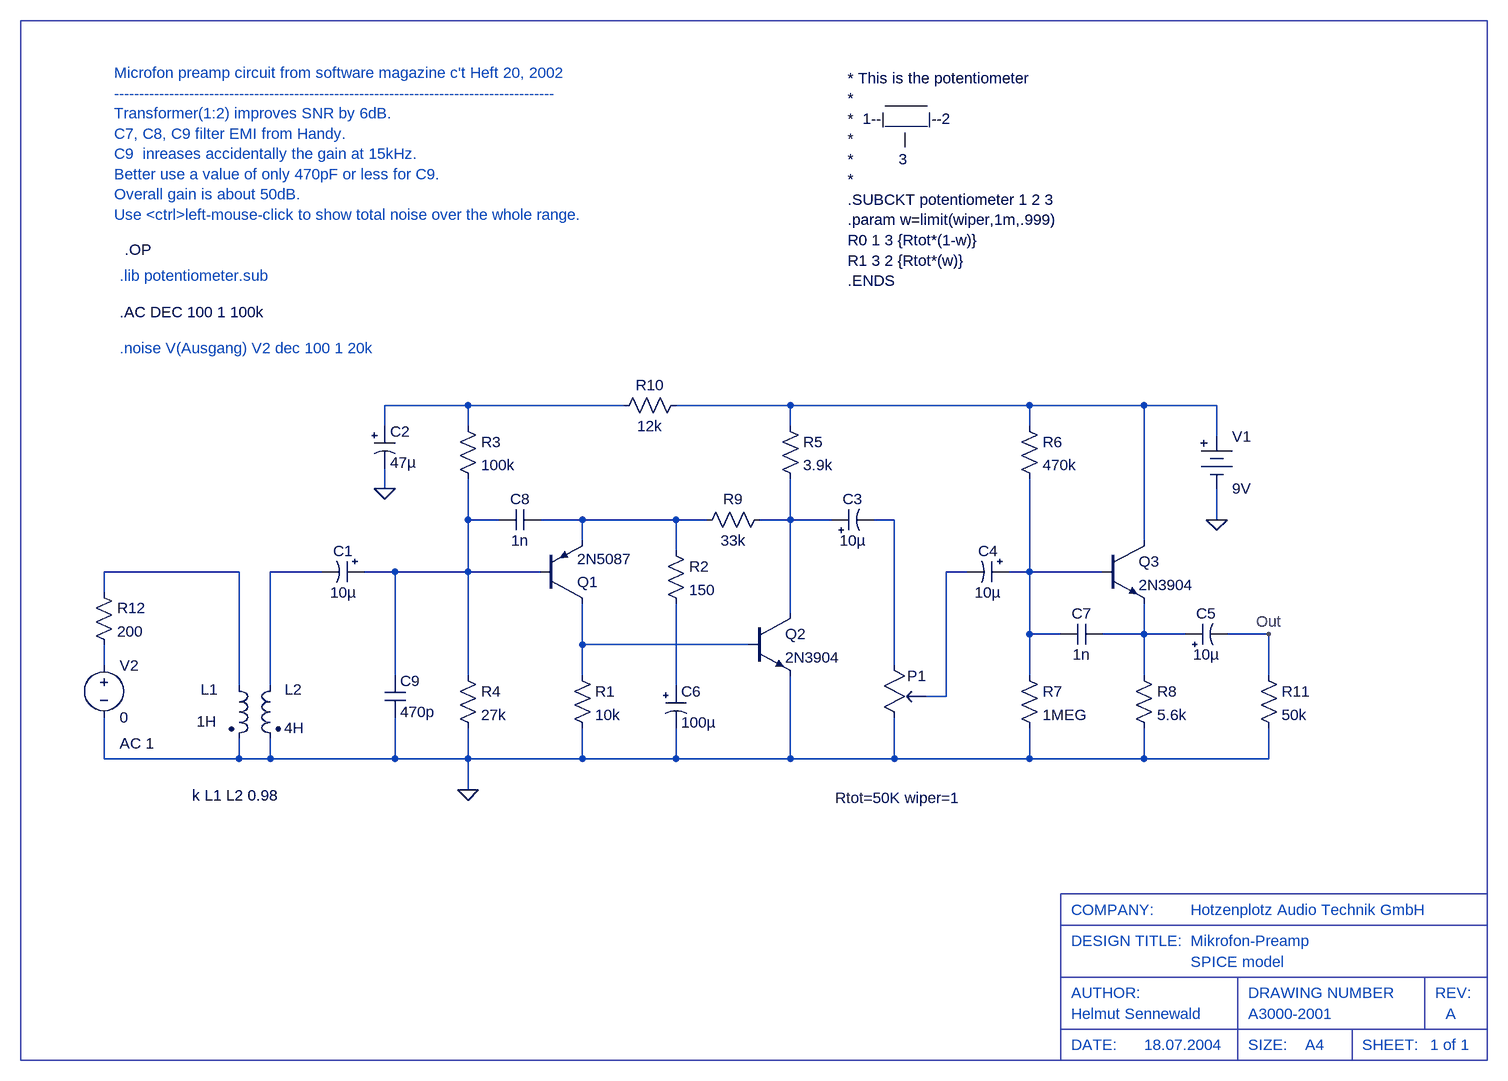
[diagram p0: schematic p4_example.asc]
p4_example.asc, the LTspice schematic file:
Version 4
SHEET 1 2260 1604
WIRE 128 880 128 848
WIRE 128 992 128 960
WIRE 128 1136 128 1072
WIRE 336 848 128 848
WIRE 336 1024 336 848
WIRE 336 1136 128 1136
WIRE 336 1136 336 1104
WIRE 384 1024 384 848
WIRE 384 1136 336 1136
WIRE 384 1136 384 1104
WIRE 464 848 384 848
WIRE 560 624 560 592
WIRE 560 720 560 688
WIRE 576 848 528 848
WIRE 576 1008 576 848
WIRE 576 1136 384 1136
WIRE 576 1136 576 1072
WIRE 688 592 560 592
WIRE 688 624 688 592
WIRE 688 768 688 704
WIRE 688 848 576 848
WIRE 688 848 688 768
WIRE 688 1008 688 848
WIRE 688 1136 576 1136
WIRE 688 1136 688 1088
WIRE 688 1184 688 1136
WIRE 736 768 688 768
WIRE 800 848 688 848
WIRE 864 768 800 768
WIRE 864 800 864 768
WIRE 864 960 864 896
WIRE 864 1008 864 960
WIRE 864 1136 688 1136
WIRE 864 1136 864 1088
WIRE 928 592 688 592
WIRE 1008 768 864 768
WIRE 1008 816 1008 768
WIRE 1008 1024 1008 896
WIRE 1008 1136 864 1136
WIRE 1008 1136 1008 1088
WIRE 1056 768 1008 768
WIRE 1120 960 864 960
WIRE 1184 592 1008 592
WIRE 1184 624 1184 592
WIRE 1184 768 1136 768
WIRE 1184 768 1184 704
WIRE 1184 912 1184 768
WIRE 1184 1136 1008 1136
WIRE 1184 1136 1184 1008
WIRE 1248 768 1184 768
WIRE 1344 768 1312 768
WIRE 1344 992 1344 768
WIRE 1344 1136 1184 1136
WIRE 1344 1136 1344 1072
WIRE 1424 1040 1392 1040
WIRE 1424 1040 1424 848
WIRE 1456 848 1424 848
WIRE 1552 592 1184 592
WIRE 1552 624 1552 592
WIRE 1552 848 1520 848
WIRE 1552 848 1552 704
WIRE 1552 944 1552 848
WIRE 1552 1008 1552 944
WIRE 1552 1136 1344 1136
WIRE 1552 1136 1552 1088
WIRE 1600 944 1552 944
WIRE 1664 848 1552 848
WIRE 1728 592 1552 592
WIRE 1728 800 1728 592
WIRE 1728 944 1664 944
WIRE 1728 944 1728 896
WIRE 1728 1008 1728 944
WIRE 1728 1136 1552 1136
WIRE 1728 1136 1728 1088
WIRE 1792 944 1728 944
WIRE 1840 592 1728 592
WIRE 1840 640 1840 592
WIRE 1840 768 1840 720
WIRE 1920 944 1856 944
WIRE 1920 1008 1920 944
WIRE 1920 1136 1728 1136
WIRE 1920 1136 1920 1088
FLAG 560 720 0
FLAG 1840 768 0
FLAG 688 1184 0
FLAG 1920 944 Out
SYMBOL pnp 800 896 M180
SYMATTR InstName Q1
SYMATTR Value 2N5087
SYMBOL npn 1120 912 R0
SYMATTR InstName Q2
SYMATTR Value 2N3904
SYMBOL npn 1664 800 R0
SYMATTR InstName Q3
SYMATTR Value 2N3904
SYMBOL res 848 992 R0
SYMATTR InstName R1
SYMATTR Value 10k
SYMBOL res 992 800 R0
SYMATTR InstName R2
SYMATTR Value 150
SYMBOL res 672 608 R0
SYMATTR InstName R3
SYMATTR Value 100k
SYMBOL res 672 992 R0
SYMATTR InstName R4
SYMATTR Value 27k
SYMBOL res 1168 608 R0
SYMATTR InstName R5
SYMATTR Value 3.9k
SYMBOL res 1536 608 R0
SYMATTR InstName R6
SYMATTR Value 470k
SYMBOL res 1536 992 R0
SYMATTR InstName R7
SYMATTR Value 1MEG
SYMBOL res 1712 992 R0
SYMATTR InstName R8
SYMATTR Value 5.6k
SYMBOL res 1040 784 R270
WINDOW 0 32 56 VTop 0
WINDOW 3 0 56 VBottom 0
SYMATTR InstName R9
SYMATTR Value 33k
SYMBOL res 912 608 R270
WINDOW 0 32 56 VTop 0
WINDOW 3 0 56 VBottom 0
SYMATTR InstName R10
SYMATTR Value 12k
SYMBOL cap 736 784 R270
WINDOW 0 32 32 VTop 0
WINDOW 3 0 32 VBottom 0
SYMATTR InstName C8
SYMATTR Value 1n
SYMBOL Misc\\EuropeanPolcap 544 624 R0
SYMATTR InstName C2
SYMATTR Value 47µ
SYMBOL Misc\\EuropeanPolcap 1248 784 R270
WINDOW 0 32 32 VTop 0
WINDOW 3 0 32 VBottom 0
SYMATTR InstName C3
SYMATTR Value 10µ
SYMBOL Misc\\EuropeanPolcap 1520 832 R90
WINDOW 0 0 32 VBottom 0
WINDOW 3 32 32 VTop 0
SYMATTR InstName C4
SYMATTR Value 10µ
SYMBOL Misc\\EuropeanPolcap 1792 960 R270
WINDOW 0 32 32 VTop 0
WINDOW 3 0 32 VBottom 0
SYMATTR InstName C5
SYMATTR Value 10µ
SYMBOL res 1904 992 R0
SYMATTR InstName R11
SYMATTR Value 50k
SYMBOL Misc\\battery 1840 624 R0
SYMATTR InstName V1
SYMATTR Value 9V
SYMBOL cap 1600 960 R270
WINDOW 0 32 32 VTop 0
WINDOW 3 0 32 VBottom 0
SYMATTR InstName C7
SYMATTR Value 1n
SYMBOL Misc\\EuropeanPolcap 992 1024 R0
SYMATTR InstName C6
SYMATTR Value 100µ
SYMBOL Misc\\EuropeanPolcap 528 832 R90
WINDOW 0 0 32 VBottom 0
WINDOW 3 32 32 VTop 0
SYMATTR InstName C1
SYMATTR Value 10µ
SYMBOL cap 560 1008 R0
SYMATTR InstName C9
SYMATTR Value 470p
SYMBOL voltage 128 976 R0
WINDOW 39 0 0 Left 0
WINDOW 123 24 136 Left 0
SYMATTR Value2 AC 1
SYMATTR InstName V2
SYMATTR Value 0
SYMBOL res 112 864 R0
SYMATTR InstName R12
SYMATTR Value 200
SYMBOL potentiometer 1328 976 R0
WINDOW 3 -75 220 Left 0
SYMATTR Value Rtot=50K wiper=1
SYMATTR InstName P1
SYMATTR SpiceModel POT
SYMBOL ind2 320 1008 R0
WINDOW 0 -43 21 Left 0
WINDOW 3 -49 70 Left 0
SYMATTR InstName L1
SYMATTR Value 1H
SYMATTR SpiceLine Rser=50
SYMBOL ind2 400 1008 M0
WINDOW 0 -33 21 Left 0
WINDOW 3 -36 80 Left 0
SYMATTR InstName L2
SYMATTR Value 4H
SYMATTR SpiceLine Rser=100
TEXT 2064 1576 Left 0 ;SHEET:
TEXT 1888 1576 Left 0 ;SIZE:
TEXT 1616 1416 Left 0 ;DESIGN TITLE:
TEXT 1616 1368 Left 0 ;COMPANY:
TEXT 2176 1496 Left 0 ;REV:
TEXT 1616 1496 Left 0 ;AUTHOR:
TEXT 2168 1576 Left 0 ;1 of 1
TEXT 1976 1576 Left 0 ;A4
TEXT 1800 1368 Left 0 ;Hotzenplotz Audio Technik GmbH
TEXT 2192 1528 Left 0 ;A
TEXT 1888 1496 Left 0 ;DRAWING NUMBER
TEXT 1888 1528 Left 0 ;A3000-2001
TEXT 1616 1528 Left 0 ;Helmut Sennewald
TEXT 1616 1576 Left 0 ;DATE:
TEXT 1800 1416 Left 0 ;Mikrofon-Preamp
TEXT 1800 1448 Left 0 ;SPICE model
TEXT 1728 1576 Left 0 ;18.07.2004
TEXT 152 448 Left 0 !.AC DEC 100 1 100k
TEXT 152 392 Left 0 ;.lib potentiometer.sub
TEXT 264 1192 Left 0 !k L1 L2 0.98
TEXT 144 80 Left 0 ;Microfon preamp circuit from software magazine c't Heft 20, 2002\n----------------------------------------------------------------------------------------\nTransformer(1:2) improves SNR by 6dB.\nC7, C8, C9 filter EMI from Handy.\nC9  inreases accidentally the gain at 15kHz.\nBetter use a value of only 470pF or less for C9.\nOverall gain is about 50dB.\nUse <ctrl>left-mouse-click to show total noise over the whole range.
TEXT 152 504 Left 0 ;.noise V(Ausgang) V2 dec 100 1 20k
TEXT 1272 88 Left 0 !* This is the potentiometer\n*       _____\n*  1--|_____|--2\n*           |\n*          3\n*\n.SUBCKT potentiometer 1 2 3\n.param w=limit(wiper,1m,.999)\nR0 1 3 {Rtot*(1-w)}\nR1 3 2 {Rtot*(w)}\n.ENDS
TEXT 160 352 Left 0 !.OP
RECTANGLE Normal 0 0 2256 1600
RECTANGLE Normal 2256 1600 2048 1552
RECTANGLE Normal 2048 1600 1872 1552
RECTANGLE Normal 2256 1472 1600 1392
RECTANGLE Normal 2256 1392 1600 1344
RECTANGLE Normal 1872 1600 1600 1552
RECTANGLE Normal 2256 1552 2160 1472
RECTANGLE Normal 1872 1552 1600 1472
RECTANGLE Normal 2160 1552 1872 1472

The netlist it stands for:
* p4_example.asc
Q1 N007 N005 N006 0 2N5087
Q2 N010 N007 0 0 2N3904
Q3 N009 N013 N014 0 2N3904
R1 N007 0 10k
R2 N006 N008 150
R3 N004 N005 100k
R4 N005 0 27k
R5 N009 N010 3.9k
R6 N009 N013 470k
R7 N013 0 1MEG
R8 N014 0 5.6k
R9 N006 N010 33k
R10 N004 N009 12k
C8 N005 N006 1n
C2 N004 0 47µ
C3 N010 N011 10µ
C4 N013 N012 10µ
C5 N014 Out 10µ
R11 Out 0 50k
V1 N009 0 9V
C7 N013 N014 1n
C6 N008 0 100µ
C1 N005 N003 10µ
C9 N005 0 470p
V2 N002 0 0 AC 1
R12 N001 N002 200
XP1 N011 0 N012 POT Rtot=50K wiper=1  ; pins A B C
L1 N001 0 1H Rser=50
L2 N003 0 4H Rser=100
.model NPN NPN
.model PNP PNP
.lib standard.bjt
* SHEET:
* SIZE:
* DESIGN TITLE:
* COMPANY:
* REV:
* AUTHOR:
* 1 of 1
* A4
* Hotzenplotz Audio Technik GmbH
* A
* DRAWING NUMBER
* A3000-2001
* Helmut Sennewald
* DATE:
* Mikrofon-Preamp
* SPICE model
* 18.07.2004
.AC DEC 100 1 100k
* .lib potentiometer.sub
k L1 L2 0.98
* Microfon preamp circuit from software magazine c't Heft 20, 2002
* ----------------------------------------------------------------------------------------
* Transformer(1:2) improves SNR by 6dB.
* C7, C8, C9 filter EMI from Handy.
* C9  inreases accidentally the gain at 15kHz.
* Better use a value of only 470pF or less for C9.
* Overall gain is about 50dB.
* Use <ctrl>left-mouse-click to show total noise over the whole range.
* .noise V(Ausgang) V2 dec 100 1 20k
* This is the potentiometer
*       _____
*  1--|_____|--2
*           |
*          3
*
.SUBCKT potentiometer 1 2 3
.param w=limit(wiper,1m,.999)
R0 1 3 {Rtot*(1-w)}
R1 3 2 {Rtot*(w)}
.ENDS
.OP
.backanno
.end